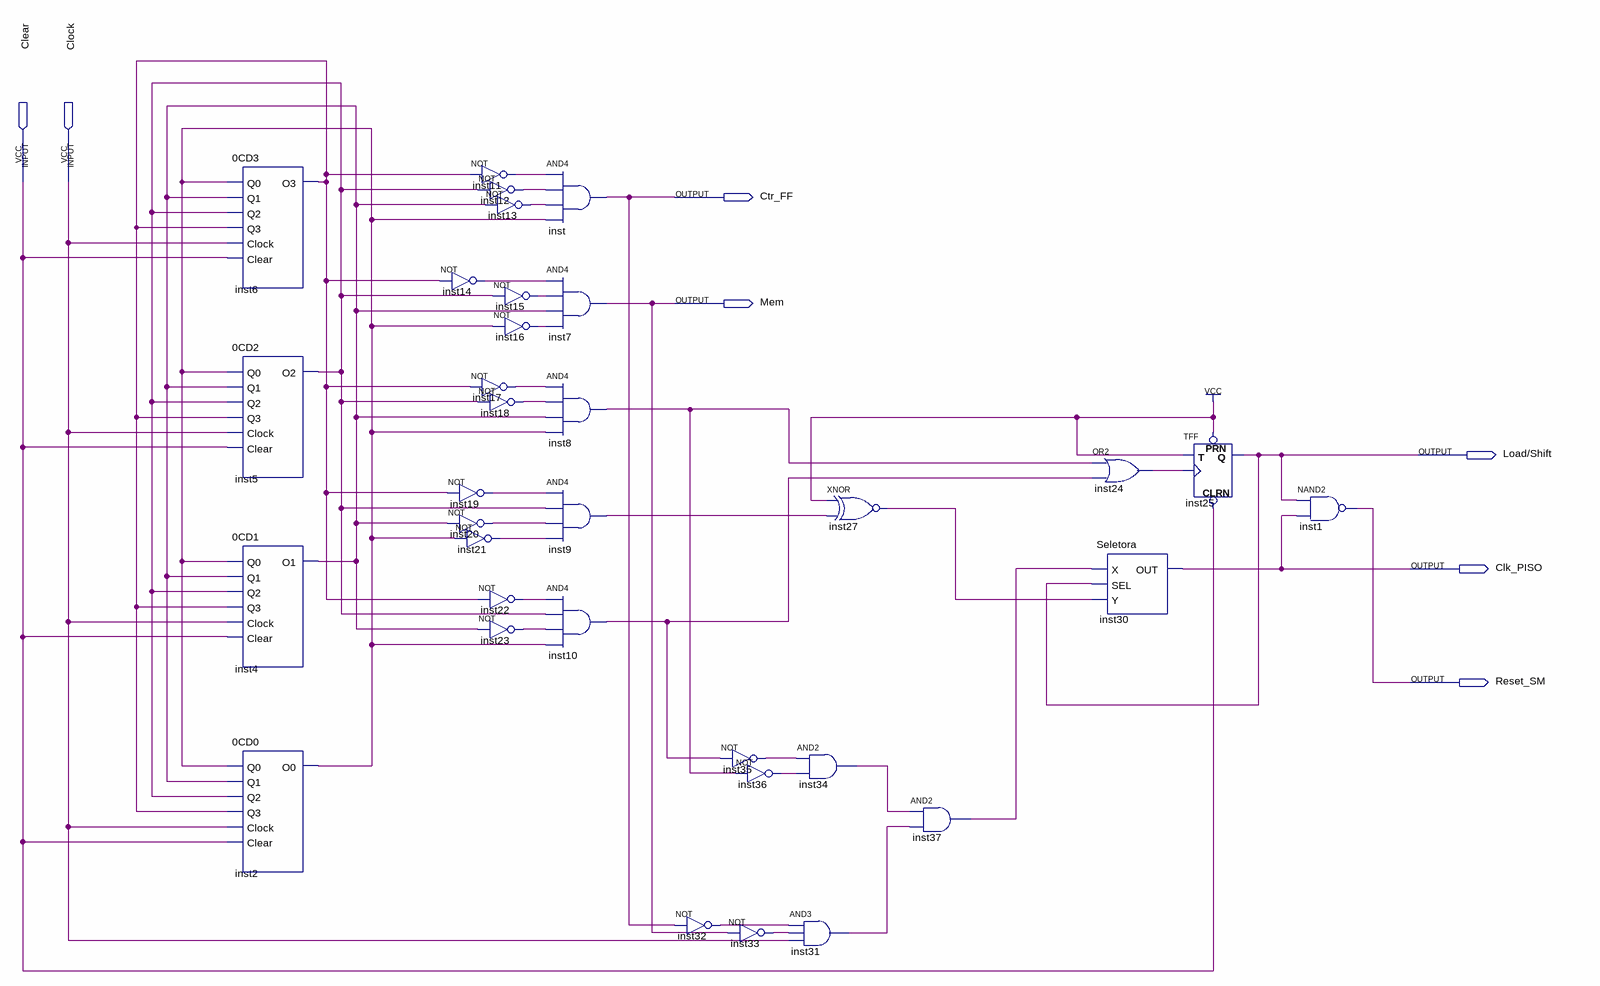
[diagram p0: schematic sheet]
// Quartus schematic Contador0C.bdf as structural Verilog: 34 symbols, 7 pins
module Contador0C (
  input  Clear,
  input  Clock,
  output Ctr_FF,
  output Mem,
  output \Load/Shift ,
  output Clk_PISO,
  output Reset_SM
);

  wire inst2_o0, inst4_o1, inst5_o2, inst6_o3, inst8_out, inst9_out, inst10_out, inst11_out, inst12_out,
       inst13_out, inst14_out, inst15_out, inst16_out, inst17_out, inst18_out, inst19_out, inst20_out,
       inst21_out, inst22_out, inst23_out, inst24_out, inst27_out, inst31_out, inst32_out, inst33_out,
       inst34_out, inst35_out, inst36_out, inst37_out;

  \0CD3  inst6 (
    .Q0(inst2_o0), .Q1(inst4_o1), .Q2(inst5_o2), .Q3(inst6_o3), .Clock(Clock), .Clear(Clear), .O3(inst6_o3));
  \0CD2  inst5 (
    .Q0(inst2_o0), .Q1(inst4_o1), .Q2(inst5_o2), .Q3(inst6_o3), .Clock(Clock), .Clear(Clear), .O2(inst5_o2));
  \0CD1  inst4 (
    .Q0(inst2_o0), .Q1(inst4_o1), .Q2(inst5_o2), .Q3(inst6_o3), .Clock(Clock), .Clear(Clear), .O1(inst4_o1));
  \0CD0  inst2 (
    .Q0(inst2_o0), .Q1(inst4_o1), .Q2(inst5_o2), .Q3(inst6_o3), .Clock(Clock), .Clear(Clear), .O0(inst2_o0));
  not inst11 (inst11_out, inst6_o3);
  not inst12 (inst12_out, inst5_o2);
  not inst14 (inst14_out, inst6_o3);
  not inst17 (inst17_out, inst6_o3);
  not inst18 (inst18_out, inst5_o2);
  not inst19 (inst19_out, inst6_o3);
  not inst20 (inst20_out, inst4_o1);
  not inst21 (inst21_out, inst2_o0);
  not inst22 (inst22_out, inst6_o3);
  not inst23 (inst23_out, inst4_o1);
  not inst13 (inst13_out, inst4_o1);
  not inst15 (inst15_out, inst5_o2);
  not inst16 (inst16_out, inst2_o0);
  and inst (Ctr_FF, inst11_out, inst12_out, inst13_out, inst2_o0);
  and inst7 (Mem, inst14_out, inst15_out, inst4_o1, inst16_out);
  and inst8 (inst8_out, inst17_out, inst18_out, inst4_o1, inst2_o0);
  and inst9 (inst9_out, inst19_out, inst5_o2, inst20_out, inst21_out);
  and inst10 (inst10_out, inst22_out, inst5_o2, inst23_out, inst2_o0);
  not inst35 (inst35_out, inst10_out);
  not inst32 (inst32_out, Ctr_FF);
  not inst36 (inst36_out, inst8_out);
  not inst33 (inst33_out, Mem);
  xnor inst27 (inst27_out, 1'b1, inst9_out);
  and inst34 (inst34_out, inst35_out, inst36_out);
  and inst31 (inst31_out, inst32_out, inst33_out, Clock);
  and inst37 (inst37_out, inst34_out, inst31_out);
  or inst24 (inst24_out, inst8_out, inst10_out);
  Seletora inst30 (.X(inst37_out), .SEL(\Load/Shift ), .Y(inst27_out), .OUT(Clk_PISO));
  TFF inst25 (.PRN(1'b1), .CLRN(Clear), .T(1'b1), .CLK(inst24_out), .Q(\Load/Shift ));
  nand inst1 (Reset_SM, \Load/Shift , Clk_PISO);
endmodule
